# Altium schematic sheet shdn_circuit.SchDoc
size A4
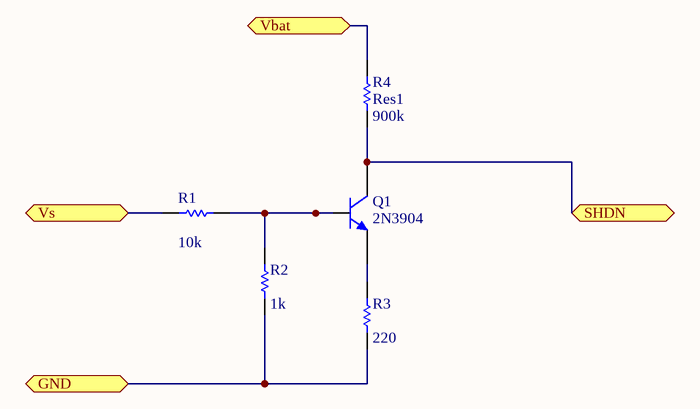
[diagram p0: shdn_circuit.SchDoc]

## Parts
Q1  2N3904  [TO-92A]
R1  value 10k  [AXIAL-0.3]  (hidden comment: Res1)
R2  value 1k  [AXIAL-0.3]  (hidden comment: Res1)
R3  value 220  [AXIAL-0.3]  (hidden comment: Res1)
R4  Res1  value 900k  [AXIAL-0.3]

## Ports
GND (bidir), SHDN (bidir), Vbat (bidir), Vs (bidir)

## Nets
GND: R2.1 R3.1 ; port GND
SHDN: Q1.3(C) R4.2 ; port SHDN
Vbat: R4.1 ; port Vbat
Vs: R1.1 ; port Vs
NetQ1_1: Q1.1(E) R3.2
NetQ1_2: Q1.2(B) R1.2 R2.2

## Library data of the parts
Q1 = 2N3904: NPN General Purpose Amplifier; Published: 8-Jun-2000; LatestRevisionDate: 15-Jan-2003; LatestRevisionNote: PCB Footprint 'BCY-W3/D4.7' replaced; DatasheetVersion: 1997; PackageVersion: Sep-1998; PackageReference: TO-92A; Publisher: Altium Limited; PackageDescription: TO, Flat Index; 3 In-Line, Axial Leads; Body Dia. 4.5mm; Leads 0.51 x 0.48 mm (max); ComponentLink1Description: Manufacturer Link; ComponentLink1URL: http://www.fairchildsemi.com/; ComponentLink2Description: Datasheet; ComponentLink2URL: http://www.fairchildsemi.com/ds/2N%2F2N3904.pdf
R1-R4 = Res1: Resistor; Published: 8-Jun-2000; LatestRevisionDate: 17-Jul-2002; LatestRevisionNote: Re-released for DXP Platform.; PackageReference: AXIAL-0.3; Publisher: Altium Limited; PackageDescription: Axial Device, Thru-Hole; 2 Leads; 0.3 in Pin Spacing